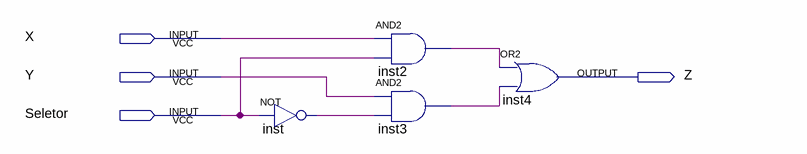
[diagram p0: schematic sheet]
// Quartus schematic MUX_simples (2).bdf as structural Verilog: 4 symbols, 4 pins
module \MUX_simples_(2)  (
  input  X,
  input  Y,
  input  Seletor,
  output Z
);

  wire inst2_out, inst3_out, inst_out;

  not inst (inst_out, Seletor);
  and inst2 (inst2_out, X, Seletor);
  and inst3 (inst3_out, Y, inst_out);
  or inst4 (Z, inst2_out, inst3_out);
endmodule
